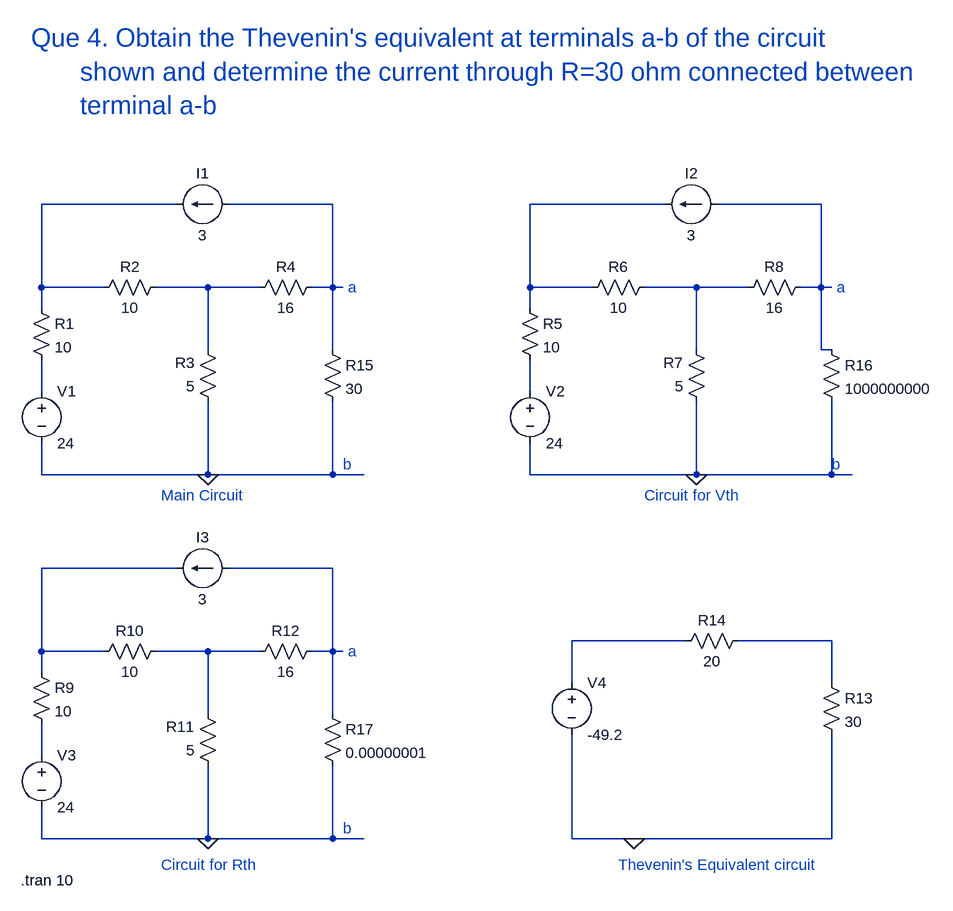
[diagram p0: schematic 4_Dheerendra_23EE019_Thevenins.asc]
4_Dheerendra_23EE019_Thevenins.asc, the LTspice schematic file:
Version 4
SHEET 1 1480 944
WIRE 208 -112 0 -112
WIRE 448 -112 288 -112
WIRE 960 -112 752 -112
WIRE 1200 -112 1040 -112
WIRE 0 16 0 -112
WIRE 96 16 0 16
WIRE 256 16 176 16
WIRE 336 16 256 16
WIRE 448 16 448 -112
WIRE 448 16 416 16
WIRE 464 16 448 16
WIRE 752 16 752 -112
WIRE 848 16 752 16
WIRE 1008 16 928 16
WIRE 1088 16 1008 16
WIRE 1200 16 1200 -112
WIRE 1200 16 1168 16
WIRE 1216 16 1200 16
WIRE 0 48 0 16
WIRE 752 48 752 16
WIRE 256 112 256 16
WIRE 448 112 448 16
WIRE 1008 112 1008 16
WIRE 1200 112 1200 16
WIRE 1216 112 1200 112
WIRE 0 176 0 128
WIRE 752 176 752 128
WIRE 0 304 0 256
WIRE 256 304 256 192
WIRE 256 304 0 304
WIRE 448 304 448 192
WIRE 448 304 256 304
WIRE 496 304 448 304
WIRE 752 304 752 256
WIRE 1008 304 1008 192
WIRE 1008 304 752 304
WIRE 1216 304 1216 192
WIRE 1216 304 1008 304
WIRE 1248 304 1216 304
WIRE 208 448 0 448
WIRE 448 448 288 448
WIRE 992 560 816 560
WIRE 1216 560 1072 560
WIRE 0 576 0 448
WIRE 96 576 0 576
WIRE 256 576 176 576
WIRE 336 576 256 576
WIRE 448 576 448 448
WIRE 448 576 416 576
WIRE 464 576 448 576
WIRE 0 608 0 576
WIRE 816 624 816 560
WIRE 1216 624 1216 560
WIRE 256 672 256 576
WIRE 448 672 448 576
WIRE 0 736 0 688
WIRE 0 864 0 816
WIRE 256 864 256 752
WIRE 256 864 0 864
WIRE 448 864 448 752
WIRE 448 864 256 864
WIRE 496 864 448 864
WIRE 816 864 816 704
WIRE 912 864 816 864
WIRE 1216 864 1216 704
WIRE 1216 864 912 864
FLAG 256 304 0
FLAG 1008 304 0
FLAG 256 864 0
FLAG 912 864 0
SYMBOL voltage 0 160 R0
WINDOW 123 0 0 Left 0
WINDOW 39 0 0 Left 0
SYMATTR InstName V1
SYMATTR Value 24
SYMBOL res -16 32 R0
SYMATTR InstName R1
SYMATTR Value 10
SYMBOL res 192 0 R90
WINDOW 0 0 56 VBottom 2
WINDOW 3 32 56 VTop 2
SYMATTR InstName R2
SYMATTR Value 10
SYMBOL res 272 208 R180
WINDOW 0 36 76 Left 2
WINDOW 3 36 40 Left 2
SYMATTR InstName R3
SYMATTR Value 5
SYMBOL res 320 32 R270
WINDOW 0 32 56 VTop 2
WINDOW 3 0 56 VBottom 2
SYMATTR InstName R4
SYMATTR Value 16
SYMBOL current 288 -112 R90
WINDOW 0 -32 40 VBottom 2
WINDOW 3 32 40 VTop 2
WINDOW 123 0 0 Left 0
WINDOW 39 0 0 Left 0
SYMATTR InstName I1
SYMATTR Value 3
SYMBOL voltage 752 160 R0
WINDOW 123 0 0 Left 0
WINDOW 39 0 0 Left 0
SYMATTR InstName V2
SYMATTR Value 24
SYMBOL res 736 32 R0
SYMATTR InstName R5
SYMATTR Value 10
SYMBOL res 944 0 R90
WINDOW 0 0 56 VBottom 2
WINDOW 3 32 56 VTop 2
SYMATTR InstName R6
SYMATTR Value 10
SYMBOL res 1024 208 R180
WINDOW 0 36 76 Left 2
WINDOW 3 36 40 Left 2
SYMATTR InstName R7
SYMATTR Value 5
SYMBOL res 1072 32 R270
WINDOW 0 32 56 VTop 2
WINDOW 3 0 56 VBottom 2
SYMATTR InstName R8
SYMATTR Value 16
SYMBOL current 1040 -112 R90
WINDOW 0 -32 40 VBottom 2
WINDOW 3 32 40 VTop 2
WINDOW 123 0 0 Left 0
WINDOW 39 0 0 Left 0
SYMATTR InstName I2
SYMATTR Value 3
SYMBOL voltage 0 720 R0
WINDOW 123 0 0 Left 0
WINDOW 39 0 0 Left 0
SYMATTR InstName V3
SYMATTR Value 24
SYMBOL res -16 592 R0
SYMATTR InstName R9
SYMATTR Value 10
SYMBOL res 192 560 R90
WINDOW 0 0 56 VBottom 2
WINDOW 3 32 56 VTop 2
SYMATTR InstName R10
SYMATTR Value 10
SYMBOL res 272 768 R180
WINDOW 0 36 76 Left 2
WINDOW 3 36 40 Left 2
SYMATTR InstName R11
SYMATTR Value 5
SYMBOL res 320 592 R270
WINDOW 0 32 56 VTop 2
WINDOW 3 0 56 VBottom 2
SYMATTR InstName R12
SYMATTR Value 16
SYMBOL current 288 448 R90
WINDOW 0 -32 40 VBottom 2
WINDOW 3 32 40 VTop 2
WINDOW 123 0 0 Left 0
WINDOW 39 0 0 Left 0
SYMATTR InstName I3
SYMATTR Value 3
SYMBOL res 1200 608 R0
SYMATTR InstName R13
SYMATTR Value 30
SYMBOL res 1088 544 R90
WINDOW 0 0 56 VBottom 2
WINDOW 3 32 56 VTop 2
SYMATTR InstName R14
SYMATTR Value 20
SYMBOL voltage 816 608 R0
WINDOW 123 0 0 Left 0
WINDOW 39 0 0 Left 0
SYMATTR InstName V4
SYMATTR Value -49.2
SYMBOL res 1200 96 R0
SYMATTR InstName R16
SYMATTR Value 1000000000
SYMBOL res 432 656 R0
SYMATTR InstName R17
SYMATTR Value 0.00000001
SYMBOL res 432 96 R0
SYMATTR InstName R15
SYMATTR Value 30
TEXT 472 16 Left 2 ;a
TEXT 464 288 Left 2 ;b
TEXT -16 -368 Left 4 ;Que 4. Obtain the Thevenin's equivalent at terminals a-b of the circuit\n       shown and determine the current through R=30 ohm connected between\n       terminal a-b
TEXT 1224 16 Left 2 ;a
TEXT 1216 288 Left 2 ;b
TEXT 472 576 Left 2 ;a
TEXT 464 848 Left 2 ;b
TEXT 184 336 Left 2 ;Main Circuit
TEXT 928 336 Left 2 ;Circuit for Vth
TEXT 184 904 Left 2 ;Circuit for Rth
TEXT 888 904 Left 2 ;Thevenin's Equivalent circuit
TEXT -32 928 Left 2 !.tran 10

The netlist it stands for:
* 4_Dheerendra_23EE019_Thevenins.asc
V1 N007 0 24
R1 N001 N007 10
R2 N005 N001 10
R3 0 N005 5
R4 N005 N002 16
I1 N002 N001 3
V2 N008 0 24
R5 N003 N008 10
R6 N006 N003 10
R7 0 N006 5
R8 N006 N004 16
I2 N004 N003 3
V3 N014 0 24
R9 N009 N014 10
R10 N013 N009 10
R11 0 N013 5
R12 N013 N010 16
I3 N010 N009 3
R13 N012 0 30
R14 N012 N011 20
V4 N011 0 -49.2
R16 N004 0 1000000000
R17 N010 0 0.00000001
R15 N002 0 30
* a
* b
* Que 4. Obtain the Thevenin's equivalent at terminals a-b of the circuit
*        shown and determine the current through R=30 ohm connected between
*        terminal a-b
* a
* b
* a
* b
* Main Circuit
* Circuit for Vth
* Circuit for Rth
* Thevenin's Equivalent circuit
.tran 10
.backanno
.end